# Altium schematic sheet Top Level.SchDoc
size A; SheetNumber: 1; SheetTotal: 4
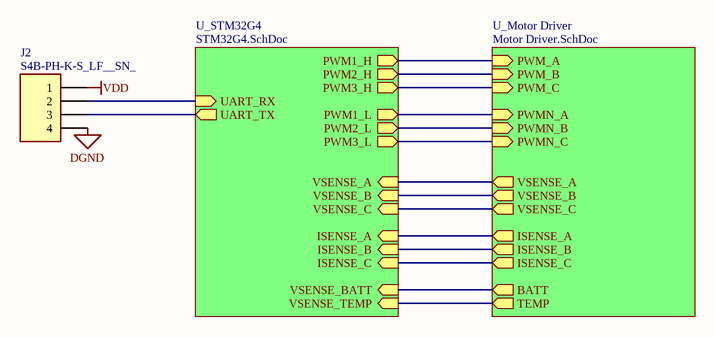
[diagram p0: Top Level.SchDoc]

## Parts
J2  S4B-PH-K-S_LF__SN_  [SHDRRA4W50P0X200_1X4_990X760X480P]

## Sub-sheets
U_Motor Driver = Motor Driver.SchDoc: ISENSE_A (out), ISENSE_B (out), ISENSE_C (out), VSENSE_A (out), VSENSE_B (out), VSENSE_C (out), PWM_A (in), PWM_B (in), PWM_C (in), PWMN_A (in), PWMN_B (in), PWMN_C (in), BATT (out), TEMP (out)
U_STM32G4 = STM32G4.SchDoc: PWM1_H (out), PWM1_L (out), PWM2_H (out), PWM2_L (out), PWM3_H (out), PWM3_L (out), ISENSE_A (in), ISENSE_B (in), ISENSE_C (in), VSENSE_A (in), VSENSE_B (in), VSENSE_C (in), VSENSE_BATT (in), VSENSE_TEMP (in), UART_TX (out), UART_RX (in)

## Nets
DGND: J2.4
VDD: J2.1
NetJ2_2: J2.2 ; sheet U_STM32G4/UART_RX
NetJ2_3: J2.3 ; sheet U_STM32G4/UART_TX
(unnamed): sheet U_Motor Driver/ISENSE_A, sheet U_STM32G4/ISENSE_A
(unnamed): sheet U_Motor Driver/ISENSE_B, sheet U_STM32G4/ISENSE_B
(unnamed): sheet U_Motor Driver/ISENSE_C, sheet U_STM32G4/ISENSE_C
(unnamed): sheet U_Motor Driver/VSENSE_A, sheet U_STM32G4/VSENSE_A
(unnamed): sheet U_Motor Driver/VSENSE_B, sheet U_STM32G4/VSENSE_B
(unnamed): sheet U_Motor Driver/VSENSE_C, sheet U_STM32G4/VSENSE_C
(unnamed): sheet U_Motor Driver/PWM_A, sheet U_STM32G4/PWM1_H
(unnamed): sheet U_Motor Driver/PWM_B, sheet U_STM32G4/PWM2_H
(unnamed): sheet U_Motor Driver/PWM_C, sheet U_STM32G4/PWM3_H
(unnamed): sheet U_Motor Driver/PWMN_A, sheet U_STM32G4/PWM1_L
(unnamed): sheet U_Motor Driver/PWMN_B, sheet U_STM32G4/PWM2_L
(unnamed): sheet U_Motor Driver/PWMN_C, sheet U_STM32G4/PWM3_L
(unnamed): sheet U_Motor Driver/BATT, sheet U_STM32G4/VSENSE_BATT
(unnamed): sheet U_Motor Driver/TEMP, sheet U_STM32G4/VSENSE_TEMP

## Library data of the parts
J2 = S4B-PH-K-S_LF__SN_: 1x4P 4P PH Tin 4 -25℃~+85℃ 2A 1 2mm Brass Right Angle Through Hole,Right Angle,P=2mm Wire To Board Connector ROHS; Manufacturer_Name: JST (JAPAN SOLDERLESS TERMINALS); Manufacturer_Part_Number: S4B-PH-K-S(LF)(SN); Datasheet Link: https://datasheet.lcsc.com/szlcsc/JST-Sales-America-PHsocket-1-4P-Curved-needle-pitch2mm_C157926.pdf; Height: 4.8mm; Mouser Part Number: N/A; Mouser Price/Stock: https://www.mouser.co.uk/ProductDetail/JST-Commercial/S4B-PH-K-SLFSN?qs=QpmGXVUTftEGA16rwNx4xw%3D%3D; Arrow Part Number: S4B-PH-K-S(LF)(SN); Arrow Price/Stock: https://www.arrow.com/en/products/s4b-ph-k-s-lf-sn/jst-manufacturing?utm_currency=USD&region=europe; LCSC Part #: C157926